# EAGLE board FPGA_S6 (EAGLE 9.6.2)
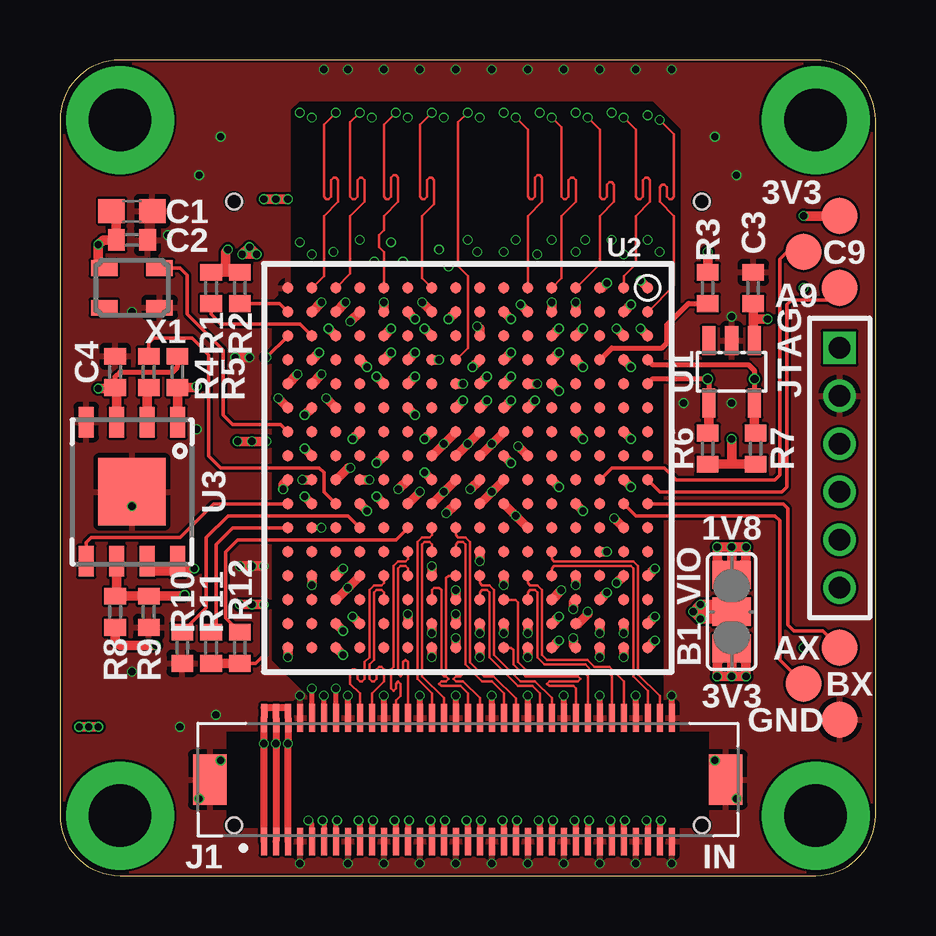
[diagram p3: board, top side]
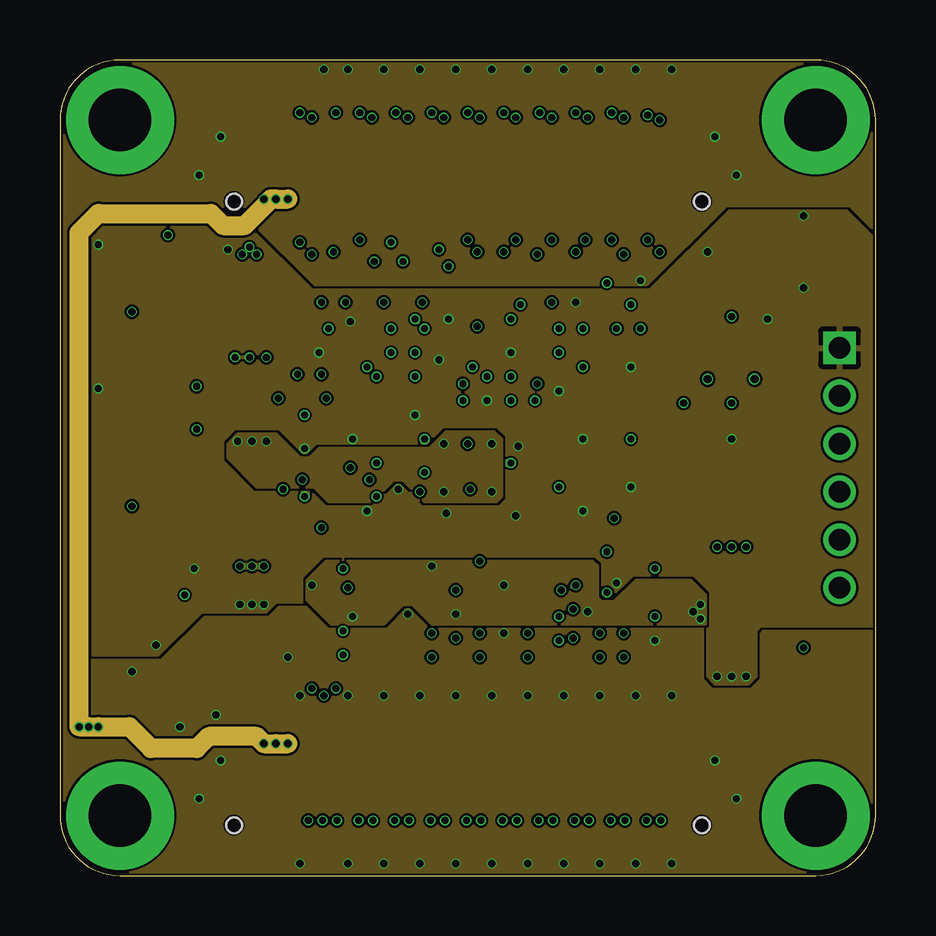
[diagram p4: board, inner layer Route2]
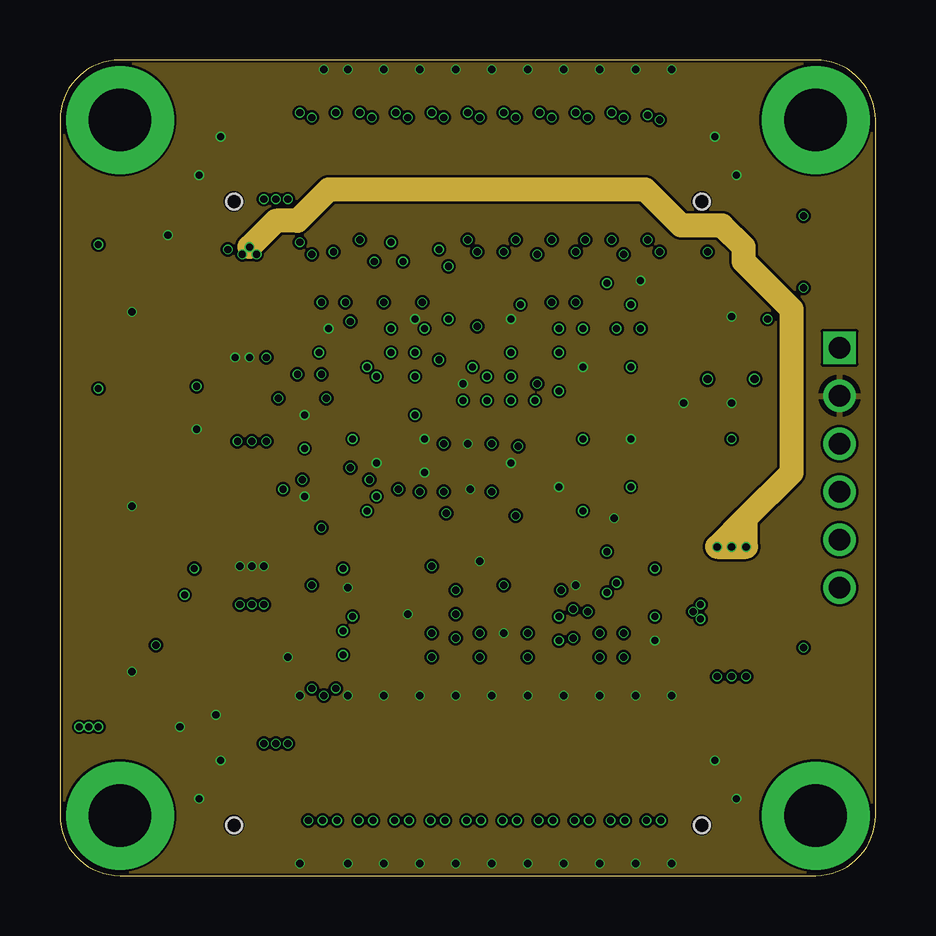
[diagram p5: board, inner layer Route3]
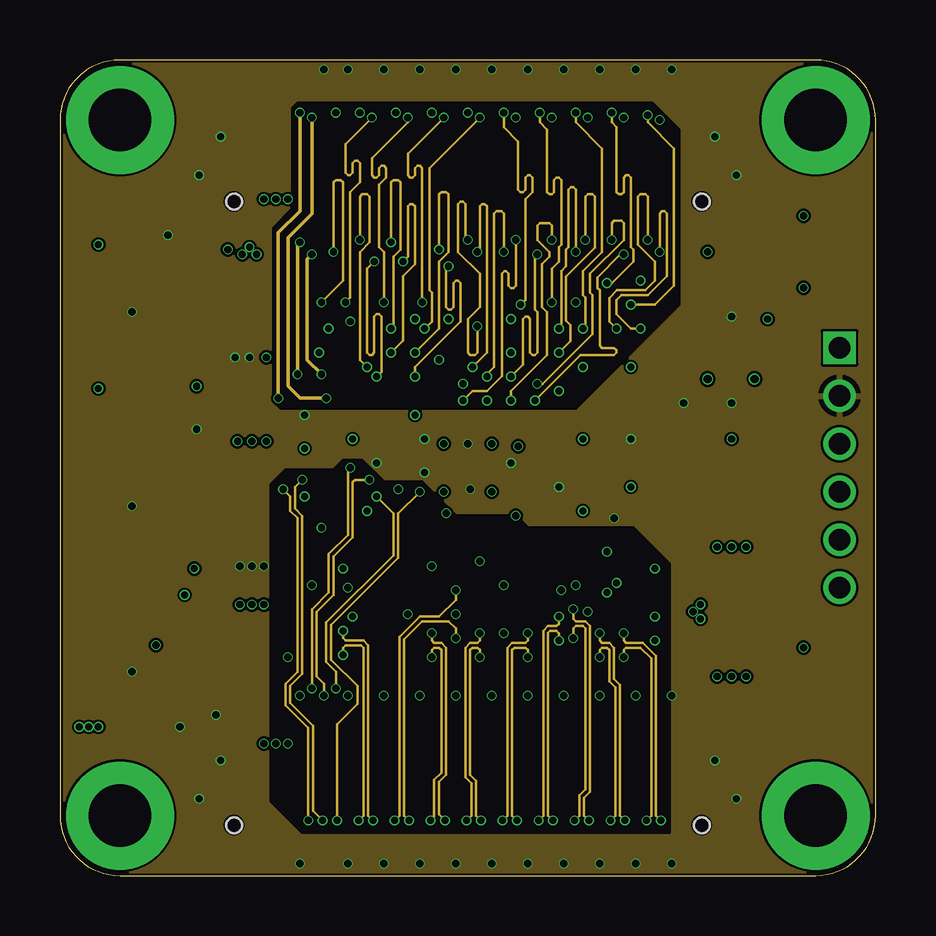
[diagram p6: board, inner layer Route14]
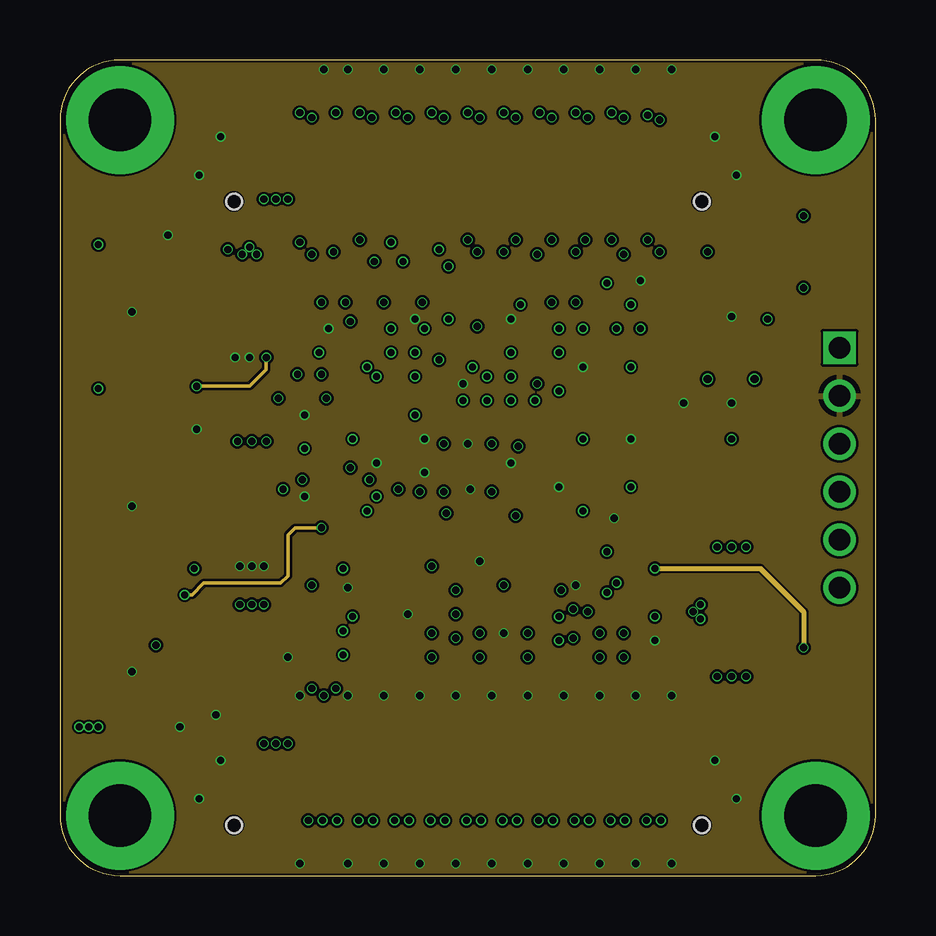
[diagram p7: board, inner layer Route15]
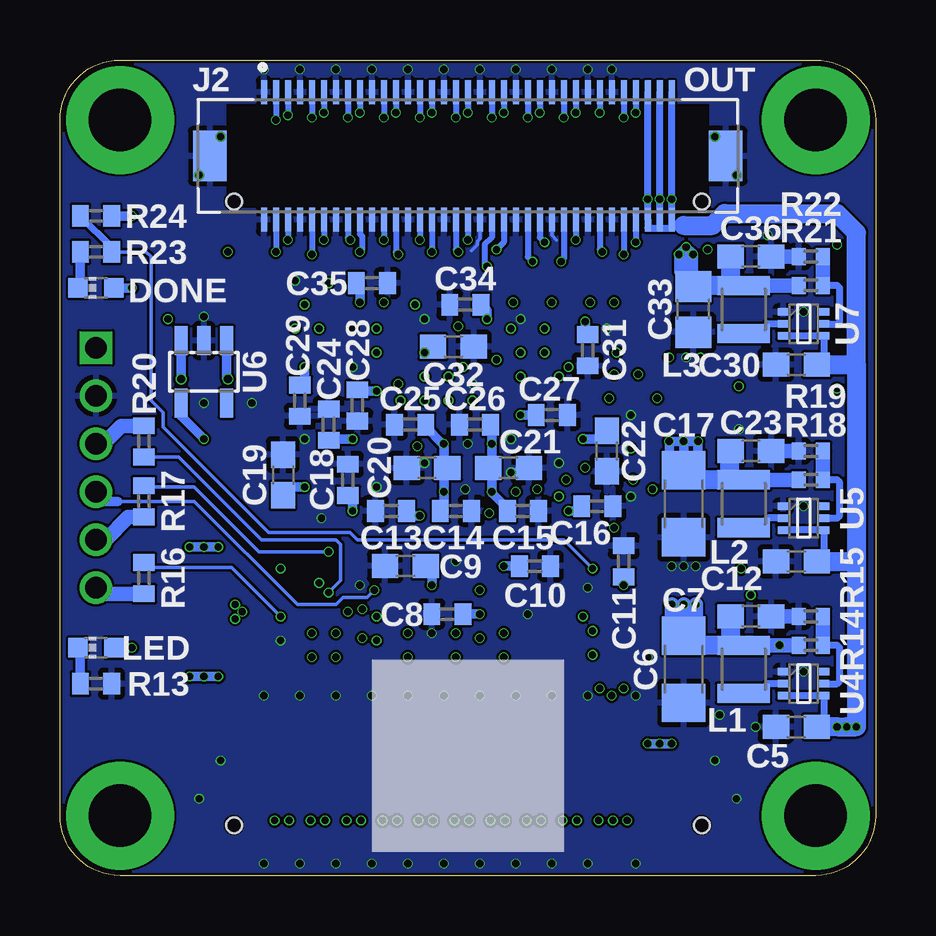
[diagram p8: board, bottom side, seen from below]

Size 34 x 34 mm. Coordinates in mm from the lower left corner, seen from the top.
Outline: 0,31.5 0,2.5 arc90 2.5,0 31.5,0 arc90 34,2.5 34,31.5 arc90 31.5,34 2.5,34 arc90 0,31.5
Copper layers (1+2*3+14*15+16): Top 0.035559375mm / dielectric 0.17018125mm / Route2 0.01778125mm / dielectric 47mil / Route3 0.0356mm / dielectric 0.2007mm / Route14 0.0356mm / dielectric 0.1499mm / Route15 0.01778125mm / dielectric 0.17018125mm / Bottom 0.035559375mm
Design rules "jlcpcb-4-layer *": minimum track width 0.08mm, minimum drill 0.2mm, track to track 0.1mm, track to pad 5mil, pad to pad 5mil, via to via 5mil, smd to smd 0mil, copper to edge 0.1mm, drill to drill 5mil, minimum pad ring 4mil, minimum via ring 0.05mm, stop-mask expansion 3mil, vias tented up to drill 100mil, thermal gap 8mil
Net classes: 0 default: width 0.14 mm, drill 0.3 mm

## Footprints (pad centres in the part's own frame; a part is rotated, then mirrored left to right if it is on the bottom)
TP15R = smd 1.5 x 1.5: TP 0,0
SJ_2 = smd 1.168 x 1.6: 1 -1.524,0; 2 0,0; 3 1.524,0
C0603 = smd 1.1 x 1: 1 -0.85,0; 2 0.85,0
C0402 = smd 0.7 x 0.9: 1 -0.65,0; 2 0.65,0
C1206 = smd 1.6 x 1.8: 1 -1.4,0; 2 1.4,0
C0805 = smd 1.3 x 1.5: 1 -0.95,0; 2 0.95,0
CHIP-LED0603 = smd 0.8 x 0.8: A 0,-0.75; C 0,0.75
DF17(2.0)-70DP-0.5V(57) = smd 0.25 x 1.15: 1 -8.5,-2.575; 2 -8.5,2.575; 3 -8,-2.575; 4 -8,2.575; 5 -7.5,-2.575; 6 -7.5,2.575; 7 -7,-2.575; 8 -7,2.575; 9 -6.5,-2.575; 10 -6.5,2.575; 11 -6,-2.575; 12 -6,2.575; 13 -5.5,-2.575; 14 -5.5,2.575; 15 -5,-2.575; 16 -5,2.575; 17 -4.5,-2.575; 18 -4.5,2.575; 19 -4,-2.575; 20 -4,2.575; 21 -3.5,-2.575; 22 -3.5,2.575; 23 -3,-2.575; 24 -3,2.575; 25 -2.5,-2.575; 26 -2.5,2.575; 27 -2,-2.575; 28 -2,2.575; 29 -1.5,-2.575; 30 -1.5,2.575; 31 -1,-2.575; 32 -1,2.575; 33 -0.5,-2.575; 34 -0.5,2.575; 35 0,-2.575; 36 0,2.575; 37 0.5,-2.575; 38 0.5,2.575; 39 1,-2.575; 40 1,2.575; 41 1.5,-2.575; 42 1.5,2.575; 43 2,-2.575; 44 2,2.575; 45 2.5,-2.575; 46 2.5,2.575; 47 3,-2.575; 48 3,2.575; 49 3.5,-2.575; 50 3.5,2.575; 51 4,-2.575; 52 4,2.575; 53 4.5,-2.575; 54 4.5,2.575; 55 5,-2.575; 56 5,2.575; 57 5.5,-2.575; 58 5.5,2.575; 59 6,-2.575; 60 6,2.575; 61 6.5,-2.575; 62 6.5,2.575; 63 7,-2.575; 64 7,2.575; 65 7.5,-2.575; 66 7.5,2.575; 67 8,-2.575; 68 8,2.575; 69 8.5,-2.575; 70 8.5,2.575 | smd 1.4 x 2.1: S1 -10.75,0; S2 10.75,0 | hole 0.65: -9.75,-1.9; 9.75,-1.9
DF17(3.0)-70DS-0.5V(57) = smd 0.25 x 1: 1 -8.5,2.65; 2 -8.5,-2.65; 3 -8,2.65; 4 -8,-2.65; 5 -7.5,2.65; 6 -7.5,-2.65; 7 -7,2.65; 8 -7,-2.65; 9 -6.5,2.65; 10 -6.5,-2.65; 11 -6,2.65; 12 -6,-2.65; 13 -5.5,2.65; 14 -5.5,-2.65; 15 -5,2.65; 16 -5,-2.65; 17 -4.5,2.65; 18 -4.5,-2.65; 19 -4,2.65; 20 -4,-2.65; 21 -3.5,2.65; 22 -3.5,-2.65; 23 -3,2.65; 24 -3,-2.65; 25 -2.5,2.65; 26 -2.5,-2.65; 27 -2,2.65; 28 -2,-2.65; 29 -1.5,2.65; 30 -1.5,-2.65; 31 -1,2.65; 32 -1,-2.65; 33 -0.5,2.65; 34 -0.5,-2.65; 35 0,2.65; 36 0,-2.65; 37 0.5,2.65; 38 0.5,-2.65; 39 1,2.65; 40 1,-2.65; 41 1.5,2.65; 42 1.5,-2.65; 43 2,2.65; 44 2,-2.65; 45 2.5,2.65; 46 2.5,-2.65; 47 3,2.65; 48 3,-2.65; 49 3.5,2.65; 50 3.5,-2.65; 51 4,2.65; 52 4,-2.65; 53 4.5,2.65; 54 4.5,-2.65; 55 5,2.65; 56 5,-2.65; 57 5.5,2.65; 58 5.5,-2.65; 59 6,2.65; 60 6,-2.65; 61 6.5,2.65; 62 6.5,-2.65; 63 7,2.65; 64 7,-2.65; 65 7.5,2.65; 66 7.5,-2.65; 67 8,2.65; 68 8,-2.65; 69 8.5,2.65; 70 8.5,-2.65 | smd 1.4 x 2.1: S1 -10.75,0; S2 10.75,0 | hole 0.65: -9.75,-1.9; 9.75,-1.9
1X06M = drill 0.914 square: 1 -5,0 | drill 0.914: 2 -3,0; 3 -1,0; 4 1,0; 5 3,0; 6 5,0
L1008 = smd 0.8 x 2.2: 1 -1,0; 2 1,0
R0402 = smd 0.7 x 0.9: 1 -0.65,0; 2 0.65,0
R0402' = smd 0.6 x 0.7: 1 -0.5,0; 2 0.5,0
SOT23-5L = smd 0.55 x 1.2: 1 -0.95,-1.3; 2 0,-1.3; 3 0.95,-1.3; 4 0.95,1.3; 5 -0.95,1.3
FT256 = smd 0.45 x 0.45: A1 -7.5,7.5; A2 -6.5,7.5; A3 -5.5,7.5; A4 -4.5,7.5; A5 -3.5,7.5; A6 -2.5,7.5; A7 -1.5,7.5; A8 -0.5,7.5; A9 0.5,7.5; A10 1.5,7.5; A11 2.5,7.5; A12 3.5,7.5; A13 4.5,7.5; A14 5.5,7.5; A15 6.5,7.5; A16 7.5,7.5; B1 -7.5,6.5; B2 -6.5,6.5; B3 -5.5,6.5; B4 -4.5,6.5; B5 -3.5,6.5; B6 -2.5,6.5; B7 -1.5,6.5; B8 -0.5,6.5; B9 0.5,6.5; B10 1.5,6.5; B11 2.5,6.5; B12 3.5,6.5; B13 4.5,6.5; B14 5.5,6.5; B15 6.5,6.5; B16 7.5,6.5; C1 -7.5,5.5; C2 -6.5,5.5; C3 -5.5,5.5; C4 -4.5,5.5; C5 -3.5,5.5; C6 -2.5,5.5; C7 -1.5,5.5; C8 -0.5,5.5; C9 0.5,5.5; C10 1.5,5.5; C11 2.5,5.5; C12 3.5,5.5; C13 4.5,5.5; C14 5.5,5.5; C15 6.5,5.5; C16 7.5,5.5; D1 -7.5,4.5; D2 -6.5,4.5; D3 -5.5,4.5; D4 -4.5,4.5; D5 -3.5,4.5; D6 -2.5,4.5; D7 -1.5,4.5; D8 -0.5,4.5; D9 0.5,4.5; D10 1.5,4.5; D11 2.5,4.5; D12 3.5,4.5; D13 4.5,4.5; D14 5.5,4.5; D15 6.5,4.5; D16 7.5,4.5; E1 -7.5,3.5; E2 -6.5,3.5; E3 -5.5,3.5; E4 -4.5,3.5; E5 -3.5,3.5; E6 -2.5,3.5; E7 -1.5,3.5; E8 -0.5,3.5; E9 0.5,3.5; E10 1.5,3.5; E11 2.5,3.5; E12 3.5,3.5; E13 4.5,3.5; E14 5.5,3.5; E15 6.5,3.5; E16 7.5,3.5; F1 -7.5,2.5; F2 -6.5,2.5; F3 -5.5,2.5; F4 -4.5,2.5; F5 -3.5,2.5; F6 -2.5,2.5; F7 -1.5,2.5; F8 -0.5,2.5; F9 0.5,2.5; F10 1.5,2.5; F11 2.5,2.5; F12 3.5,2.5; F13 4.5,2.5; F14 5.5,2.5; F15 6.5,2.5; F16 7.5,2.5; G1 -7.5,1.5; G2 -6.5,1.5; G3 -5.5,1.5; G4 -4.5,1.5; G5 -3.5,1.5; G6 -2.5,1.5; G7 -1.5,1.5; G8 -0.5,1.5; G9 0.5,1.5; G10 1.5,1.5; G11 2.5,1.5; G12 3.5,1.5; G13 4.5,1.5; G14 5.5,1.5; G15 6.5,1.5; G16 7.5,1.5; H1 -7.5,0.5; H2 -6.5,0.5; H3 -5.5,0.5; H4 -4.5,0.5; H5 -3.5,0.5; H6 -2.5,0.5; H7 -1.5,0.5; H8 -0.5,0.5; H9 0.5,0.5; H10 1.5,0.5; H11 2.5,0.5; H12 3.5,0.5; H13 4.5,0.5; H14 5.5,0.5; H15 6.5,0.5; H16 7.5,0.5; J1 -7.5,-0.5; J2 -6.5,-0.5; J3 -5.5,-0.5; J4 -4.5,-0.5; J5 -3.5,-0.5; J6 -2.5,-0.5; J7 -1.5,-0.5; J8 -0.5,-0.5; J9 0.5,-0.5; J10 1.5,-0.5; J11 2.5,-0.5; J12 3.5,-0.5; J13 4.5,-0.5; J14 5.5,-0.5; J15 6.5,-0.5; J16 7.5,-0.5; K1 -7.5,-1.5; K2 -6.5,-1.5; K3 -5.5,-1.5; K4 -4.5,-1.5; K5 -3.5,-1.5; K6 -2.5,-1.5; K7 -1.5,-1.5; K8 -0.5,-1.5; K9 0.5,-1.5; K10 1.5,-1.5; K11 2.5,-1.5; K12 3.5,-1.5; K13 4.5,-1.5; K14 5.5,-1.5; K15 6.5,-1.5; K16 7.5,-1.5; L1 -7.5,-2.5; L2 -6.5,-2.5; L3 -5.5,-2.5; L4 -4.5,-2.5; L5 -3.5,-2.5; L6 -2.5,-2.5; L7 -1.5,-2.5; L8 -0.5,-2.5; L9 0.5,-2.5; L10 1.5,-2.5; L11 2.5,-2.5; L12 3.5,-2.5; L13 4.5,-2.5; L14 5.5,-2.5; L15 6.5,-2.5; L16 7.5,-2.5; M1 -7.5,-3.5; M2 -6.5,-3.5; M3 -5.5,-3.5; M4 -4.5,-3.5; M5 -3.5,-3.5; M6 -2.5,-3.5; M7 -1.5,-3.5; M8 -0.5,-3.5; M9 0.5,-3.5; M10 1.5,-3.5; M11 2.5,-3.5; M12 3.5,-3.5; M13 4.5,-3.5; M14 5.5,-3.5; M15 6.5,-3.5; M16 7.5,-3.5; N1 -7.5,-4.5; N2 -6.5,-4.5; N3 -5.5,-4.5; N4 -4.5,-4.5; N5 -3.5,-4.5; N6 -2.5,-4.5; N7 -1.5,-4.5; N8 -0.5,-4.5; N9 0.5,-4.5; N10 1.5,-4.5; N11 2.5,-4.5; N12 3.5,-4.5; N13 4.5,-4.5; N14 5.5,-4.5; N15 6.5,-4.5; N16 7.5,-4.5; P1 -7.5,-5.5; P2 -6.5,-5.5; P3 -5.5,-5.5; P4 -4.5,-5.5; P5 -3.5,-5.5; P6 -2.5,-5.5; P7 -1.5,-5.5; P8 -0.5,-5.5; P9 0.5,-5.5; P10 1.5,-5.5; P11 2.5,-5.5; P12 3.5,-5.5; P13 4.5,-5.5; P14 5.5,-5.5; P15 6.5,-5.5; P16 7.5,-5.5; R1 -7.5,-6.5; R2 -6.5,-6.5; R3 -5.5,-6.5; R4 -4.5,-6.5; R5 -3.5,-6.5; R6 -2.5,-6.5; R7 -1.5,-6.5; R8 -0.5,-6.5; R9 0.5,-6.5; R10 1.5,-6.5; R11 2.5,-6.5; R12 3.5,-6.5; R13 4.5,-6.5; R14 5.5,-6.5; R15 6.5,-6.5; R16 7.5,-6.5; T1 -7.5,-7.5; T2 -6.5,-7.5; T3 -5.5,-7.5; T4 -4.5,-7.5; T5 -3.5,-7.5; T6 -2.5,-7.5; T7 -1.5,-7.5; T8 -0.5,-7.5; T9 0.5,-7.5; T10 1.5,-7.5; T11 2.5,-7.5; T12 3.5,-7.5; T13 4.5,-7.5; T14 5.5,-7.5; T15 6.5,-7.5; T16 7.5,-7.5
MT25QL128ABA1EW7-0SIT = smd 1.27 x 0.635: 1 -2.9,1.905; 2 -2.9,0.635; 3 -2.9,-0.635; 4 -2.9,-1.905; 5 2.9,-1.905; 6 2.9,-0.635; 7 2.9,0.635; 8 2.9,1.905 | smd 2.8 x 2.8: EP 0,0
SOTFL50P160X60-6N = smd 0.475 x 0.3: 1 -0.838,0.5; 2 -0.838,0; 3 -0.838,-0.5; 4 0.838,-0.5; 5 0.838,0; 6 0.838,0.5
ASE = smd 1.1 x 0.65: 1 -1.15,-0.825; 2 1.15,-0.825; 3 1.15,0.825; 4 -1.15,0.825

## Placement (x,y rotation side)
$$GND1  TPTP15R  [TP15R]  32.5,27.5 0 top
A9  TPTP15R  [TP15R]  32.5,24.5 0 top
AX  TPTP15R  [TP15R]  32.5,9.5 0 top
B1  [SJ_2]  28,11 90 top
BX  TPTP15R  [TP15R]  31,8 0 top
C1  4u7  [C0603]  3,27.7 180 top
C2  100n  [C0402]  3,26.5 0 top
C3  100n  [C0402]  28.9,24.5 90 top
C4  100n  [C0402]  2.3,21 270 top
C5  4u7  [C0603]  3.3,6.2 180 bottom
C6  100u  [C1206]  8,8.6 270 bottom
C7  22u  [C0603]  5.2,10.8 0 bottom
C8  470n  [C0402]  17.85,10.9 0 bottom
C9  4u7  [C0603]  19.6,12.9 0 bottom
C10  470n  [C0402]  14.2,12.9 180 bottom
C11  470n  [C0402]  10.5,13.1 270 bottom
C12  4u7  [C0603]  3.3,13.1 180 bottom
C13  470n  [C0402]  20.2,15.2 0 bottom
C14  47n  [C0402]  17.5,15.2 180 bottom
C15  470n  [C0402]  14.7,15.2 180 bottom
C16  470n  [C0402]  11.6,15.4 180 bottom
C17  100u  [C1206]  8,15.5 270 bottom
C18  470n  [C0402]  22,16.5 270 bottom
C19  4u7  [C0603]  24.7,16.7 270 bottom
C20  4u7  [C0603]  18.7,17 0 bottom
C21  4u7  [C0603]  15.3,17 180 bottom
C22  4u7  [C0603]  11.2,17.7 90 bottom
C23  22u  [C0603]  5.2,17.7 0 bottom
C24  470n  [C0402]  22.8,18.8 270 bottom
C25  470n  [C0402]  19.4,18.8 0 bottom
C26  47n  [C0402]  16.7,18.8 0 bottom
C27  470n  [C0402]  13.5,19.2 180 bottom
C28  470n  [C0402]  21.6,19.6 90 bottom
C29  470n  [C0402]  24,19.8 90 bottom
C30  4u7  [C0603]  3.3,21.3 180 bottom
C31  470n  [C0402]  12,21.9 90 bottom
C32  4u7  [C0603]  17.6,22.05 180 bottom
C33  47u  [C0805]  7.6,23.6 90 bottom
C34  470n  [C0402]  17.1,23.8 0 bottom
C35  470n  [C0402]  21,24.7 180 bottom
C36  22u  [C0603]  5.2,25.8 0 bottom
CC9  TPTP15R  [TP15R]  31,26 0 top
DONE  RED  [CHIP-LED0603]  32.5,24.5 90 bottom
GND  TPTP15R  [TP15R]  32.5,6.5 0 top
J1  DF17(2.0)-70DP-0.5V(57)  [DF17(2.0)-70DP-0.5V(57)]  17,4 0 top
J2  DF17(3.0)-70DS-0.5V(57)  [DF17(3.0)-70DS-0.5V(57)]  17,30 0 bottom
JTAG  [1X06M]  32.5,17 270 top
L1  1u  [L1008]  5.5,8.6 270 bottom
L2  1u  [L1008]  5.5,15.5 270 bottom
L3  1u  [L1008]  5.5,23.6 270 bottom
LED  RED  [CHIP-LED0603]  32.5,9.5 90 bottom
R1  4k7  [R0402]  6.3,24.5 90 top
R2  4k7  [R0402]  7.5,24.5 270 top
R3  1k  [R0402]  27,24.5 270 top
R4  100R  [R0402]  3.7,21 90 top
R5  2k4  [R0402]  4.9,21 90 top
R6  4k7  [R0402]  27,17.8 90 top
R7  4k7  [R0402]  29,17.8 90 top
R8  100R  [R0402]  2.3,11 90 top
R9  100R  [R0402]  3.7,11 270 top
R10  1k  [R0402]  5.1,9.5 270 top
R11  1k  [R0402]  6.3,9.5 90 top
R12  1k  [R0402]  7.5,9.5 90 top
R13  1k  [R0402]  32.5,8 180 bottom
R14  453k  [R0402']  2.7,9.6 0 bottom
R15  100k  [R0402']  2.7,10.8 0 bottom
R16  100R  [R0402]  30.5,12.4 90 bottom
R17  100R  [R0402]  30.5,15.6 90 bottom
R18  100k  [R0402']  2.7,16.5 0 bottom
R19  100k  [R0402']  2.7,17.7 0 bottom
R20  100R  [R0402]  30.5,18.1 270 bottom
R21  200k  [R0402']  2.7,24.6 0 bottom
R22  100k  [R0402']  2.7,25.8 0 bottom
R23  1k  [R0402]  32.5,26 180 bottom
R24  1k  [R0402]  32.5,27.5 0 bottom
U1  MCP9802A0T  [SOT23-5L]  28,21 180 top
U2  XC6SLX16-2FTG256I  [FT256]  17,17 270 top
U3  MT25QL128ABA1EW7-0SIT  [MT25QL128ABA1EW7-0SIT]  3,16 270 top
U4  TPS62A01ADRL  [SOTFL50P160X60-6N]  3,8 0 bottom
U5  TPS62A01ADRL  [SOTFL50P160X60-6N]  3,14.9 0 bottom
U6  24C00OT  [SOT23-5L]  28,21 180 bottom
U7  TPS62A01ADRL  [SOTFL50P160X60-6N]  3,23 0 bottom
X1  50MHz  [ASE]  3,24.5 0 top

## Tracks (layer width: path | path; a pad name or v marks a point on that pad's centre or on a via)
1.2V  (via drill 0.3)
  Top 0.4: U2.H10 v18,16 U2.G9 | U2.H8 v18,18 U2.G7 | U2.K8 v16,18 U2.J7 | U2.K10 v16,16 U2.J9 | v8.6,18.1 v8,18.1 v7.4,18.1
  Bottom 0.4: C17.1 v8,18.1 | C14.2 18,15.35 v18,16 18,16.85 C20.2 18,17.15 v18,18 18.05,18 18.75,18.7 C25.2 | C15.2 15.35,15.3 16,15.95 v16,16 16,16.85 C21.2 16,17.15 v16,18 16,18.75 C26.2 | C17.1 7.4,17.5 v7.4,18.1 v8,18.1 | C17.1 8.6,17.5 v8.6,18.1 v8,18.1
  Bottom 0.6: R18.1 L2.1 6,16.5 6.1,16.6 | C23.1 6.1,17.65
  Bottom 0.8: 6.1,17.65 6.1,16.6 | L2.1 7.6,16.5 C17.1
  pour Route2 (rank 2): 7,18 7.4,18.4 9,18.4 10,17.4 10.4,17.4 10.8,17.8 15.4,17.8 16.1,18.5 18.1,18.5 18.4,18.2 18.4,15.8 18.2,15.6 15.2,15.6 14.3,16.5 13.9,16.5 13,15.6 11.2,15.6 10.6,16.2 8.2,16.2 7,17.4
1.8V  (via drill 0.3)
  Top 0.4: B1.3 v28,13.7 | B1.3 27.4,13.12 v27.4,13.7 v28,13.7 | B1.3 28.6,13.12 v28.6,13.7 v28,13.7 | v7.6,25.9 v7.9,26.2 v8.2,25.9 v7.6,25.9
  Route3 0.4: v7.6,25.9 v7.9,26.2 v8.2,25.9
  Route3 1: 28.6,14.9 v28.6,13.7 v28,13.7 v27.4,13.7 28.6,14.9 | v7.9,26.2 9,27.3 9.9,27.3 11.2,28.6 24.4,28.6 25.9,27.1 27.6,27.1 28.5,26.2 28.5,25.6 30.5,23.6 30.5,16.8 28.6,14.9
  Bottom 0.4: C33.2 v7.6,25.9 v7.9,26.2 | C33.2 7.9,24.85 v7.9,26.2 | C33.2 8.2,25.15 v8.2,25.9 v7.9,26.2 | v27.4,13.7 v28,13.7 v28.6,13.7
  Bottom 0.6: R21.1 L3.1 6.2,24.6 6.05,24.75 | 7.45,24.6 C33.2
  Bottom 0.8: C36.1 6.05,24.75 | L3.1 7.45,24.6
3.3V  (via drill 0.3)
  Top 0.15: R12.1 8.15,8.85 8.5,9.2 v8.5,11.3
  Top 0.2: C4.2 2.3,20.8 2.5,21 4.7,21 4.9,21.2 R5.2
  Top 0.4: B1.1 v28,8.3 | B1.1 28.6,8.88 v28.6,8.3 v28,8.3 | B1.1 27.4,8.88 v27.4,8.3 v28,8.3 | U3.3 2.37,20.29 C4.2 2.25,20.3 v1.6,20.3 | R8.1 2.3,9.8 2.5,9.6 v4,9.6 | U3.8 4.9,12.8 | 4.9,12.8 4.9,12.7 3.63,12.7 U3.7 | v5.6,12.8 4.9,12.8 | R5.2 4.9,21.7 | R3.1 v27,26 | C1.2 2.35,27.5 C2.1 1.8,26.5 v1.6,26.3 1.6,25.57 X1.4 | R2.1 6.9,25.15 | 6.9,25.15 R1.2 | U2.B13 v23.2,12.2 | U2.R4 v10.8,21.8 | v12.1,23.1 U2.N2 | v15.8,21.5 U2.K4 | v16.2,23.2 U2.J2 | U2.L6 v14.8,19.2 | v12.2,18.2 U2.N7 | v10.2,17.8 U2.R8 | U2.H6 v17.8,19.8 | v18.8,21.8 U2.G4 | v20.8,20.2 U2.E5 | U2.D7 v21.8,18.2 | U2.G10 v19,15 U2.F11 | v21.8,15.2 U2.D10 | U2.B9 v23.8,16.2 | v23.8,21.2 U2.B4 | v21.5,23.9 U2.D2 | v12.8,15.2 U2.N10 | U2.L9 v14.1,16.1 | U2.J10 v16.1,15.1 | v19.1,17.9 U2.F8 | R11.1 R12.1 | v7,26.1 6.9,26 6.9,25.15 | v7.5,11.3 v8,11.3 v8.5,11.3 | R6.1 28,17.15 | 28,17.15 R7.1 | U1.1 28.9,22.35 28.9,23.2 | 28.9,23.2 C3.1 | 28.9,23.2 v29.5,23.2 | 28,17.15 v28,18.2 | $$GND1.TP v31,27.5
  Bottom 0.4: R24.2 v31,27.5 | DONE.A v31,24.5 | v21.8,18.2 22.75,18.2 C24.2 | v20.8,20.2 21.55,20.2 C28.2 | v23.8,21.2 23.8,20.65 C29.2 | v23.8,16.2 24.35,16.2 C19.2 | v21.8,15.2 21.8,15.65 C18.2 | v19,15 19.35,15 C13.2 | C27.2 v14.8,19.2 | C22.2 11.55,18.2 v12.2,18.2 | v12.8,15.2 12.45,15.2 C16.2 | C31.2 12.1,22.65 v12.1,23.1 | C32.2 18.55,22.05 v18.8,21.8 | C34.2 16.2,23.55 v16.2,23.2 | v21.5,23.9 21.5,24.55 C35.2 | v27.4,8.3 v28,8.3 v28.6,8.3 | U6.4 28.95,19.15 v28,18.2
  Bottom 0.6: R14.1 L1.1 6,9.6 6.05,9.65 | 7.6,9.6 C6.1 | C6.1 7.5,10.5 v7.5,11.3 | C6.1 v8,11.3 | C6.1 8.5,10.5 v8.5,11.3
  Bottom 0.8: C7.1 6.05,9.65 | L1.1 7.6,9.6
  pour Route2 (rank 4): 1.3,27.1 7.8,27.1 10.5,24.4 24.6,24.4 27.9,27.7 32.8,27.7 34,26.5 34,10.4 29.2,10.4 29,10.2 29,8.3 28.7,8 27.3,8 27,8.3 27,11.4 9,11.4 8.6,11 5.9,11 4.1,9.2 1.3,9.2
50MHZ
  Top 0.15: U2.T7 9.2,18.8 7.2,18.8
  Top 0.152: 7.2,18.8 6.8,19.2 6.8,21.9 5.3,23.4 5.3,25.02 5,25.32 X1.3
+5V  (via drill 0.3)
  Top 0.3: J1.3 J1.4 9,7 | J1.1 J1.2 8.5,7 9,7 | 9,7 9.5,7 J1.6 v9.5,5.5 J1.5
  Top 0.4: v8.5,28.2 v9,28.2 v9.5,28.2 | v0.8,6.2 v1.2,6.2 v1.6,6.2
  Route2 0.4: v9,28.2 v8.5,28.2
  Route2 0.8: v9.5,5.5 v9,5.5 v8.5,5.5 8.2,5.8 6.2,5.8 5.7,5.3 3.8,5.3 2.9,6.2 v1.6,6.2 v1.2,6.2 v0.8,6.2 0.8,26.8 1.6,27.6 6.3,27.6 6.8,27.1 7.7,27.1 8.8,28.2 v9,28.2 v9.5,28.2
  Bottom 0.3: U4.3 U4.4 2.16,6.26 2.1,6.2 | U5.3 U5.4 2.16,13.16 2.1,13.1 | U7.3 U7.4 2.16,21.36 2.1,21.3 | 8.5,27.1 8,27.1 | J2.69 v8.5,28.2 J2.70 8.5,27.1 | J2.67 v9,28.2 J2.68 9,27 | J2.65 v9.5,28.2 J2.66 9.5,27 9,27 | 9,27 8.5,27 8.5,27.1
  Bottom 0.4: v9.5,5.5 v9,5.5 v8.5,5.5
  Bottom 0.6: C30.1 2.1,21.3 | C12.1 2.1,13.1 | 2.1,6.2 C5.1
  Bottom 0.8: 2.1,21.3 0.8,21.3 | 2.1,13.1 0.8,13.1 | 0.8,21.3 0.8,13.1 | 0.8,13.1 v0.8,6.2 v1.2,6.2 v1.6,6.2 2.1,6.2 | 0.8,21.3 0.8,26.8 1.6,27.6 6.3,27.6 6.8,27.1 8,27.1
CMPCS
  Top 0.15: R12.2 6.9,10.75 6.9,13.5 7.4,14 14,14 U2.L11
FLASH_!CS  (via drill 0.3)
  Top 0.15: U2.T3 v8.6,21.6
  Top 0.4: U3.1 R5.1 5.65,20.35 v5.7,20.4
  Route15 0.15: v5.7,20.4 7.9,20.4 8.6,21.1 v8.6,21.6
FLASH_MISO
  Top 0.15: U2.P10 11,16 11,16.8 10.8,17 6.7,17 6.2,17.5 6.2,21.7 5.5,22.4 3.9,22.4 3.7,22.2 R4.2
FLASH_MOSI
  Top 0.15: U3.5 1.1,13.89 1.3,14.1 5,14.1 6.4,15.5 U2.T10
FLASH_SCK  (via drill 0.3)
  Top 0.15: U2.R11 v10.9,14.5
  Top 0.4: U3.6 2.37,11.71 R8.2 R9.1 5.15,11.65 v5.2,11.7
  Route15 0.15: v5.2,11.7 5.5,11.7 6,12.2 9.2,12.2 9.5,12.5 9.5,14.2 9.8,14.5 v10.9,14.5
FPGA_B15  (via drill 0.3)
  Top 0.25: v25.05,2.3 25,2.25 J1.67
  Top 0.4: v23.5,10.1 U2.B15
  Route14 0.1: v25.05,2.3 24.85,2.5 24.85,9.15 24.3,9.7 23.6,9.7 23.5,9.8 v23.5,10.1
FPGA_B16  (via drill 0.3)
  Top 0.25: v24.45,2.3 24.5,2.25 J1.65
  Top 0.4: v23.5,9.1 U2.B16
  Route14 0.1: v24.45,2.3 24.65,2.5 24.65,9.05 24.2,9.5 23.6,9.5 23.5,9.4 v23.5,9.1
FPGA_C15  (via drill 0.3)
  Top 0.25: J1.61 23.5,2.22 23.55,2.28 v23.55,2.3
  Top 0.4: U2.C15 v22.5,10.1
  Route14 0.1: v23.55,2.3 23.35,2.5 23.35,7.95 23.1,8.2 23.1,9.5 22.9,9.7 22.6,9.7 22.5,9.8 v22.5,10.1
FPGA_C16  (via drill 0.3)
  Top 0.25: J1.59 23,2.25 v22.95,2.3
  Top 0.4: U2.C16 v22.5,9.1
  Route14 0.1: v22.95,2.3 23.15,2.5 23.15,7.85 22.9,8.1 22.9,9.4 22.8,9.5 22.6,9.5 22.5,9.4 v22.5,9.1
FPGA_D14  (via drill 0.3)
  Top 0.25: v22.05,2.3 22,2.25 J1.55
  Top 0.4: U2.D14 21.4,11.4 v21.4,11.1
  Route14 0.1: v22.05,2.3 21.85,2.5 21.85,3.25 22.1,3.5 22.1,10.4 21.9,10.6 21.5,10.6 21.4,10.7 v21.4,11.1
FPGA_D16  (via drill 0.3)
  Top 0.25: J1.53 21.5,2.25 v21.45,2.3
  Top 0.4: v21.4,9.9 21.4,9.6 U2.D16
  Route14 0.1: v21.45,2.3 21.65,2.5 21.65,3.35 21.9,3.6 21.9,10.3 21.8,10.4 21.5,10.4 21.4,10.3 v21.4,9.9
FPGA_E12
  Top 0.1: J1.68 25,7.48 24.1,8.38 24.1,12.9 23.9,13.1 20.6,13.1 20.5,13.2 U2.E12
FPGA_E13
  Top 0.1: J1.66 24.5,7.7 23.9,8.3 23.9,12.8 23.8,12.9 20.6,12.9 20.5,12.8 U2.E13
FPGA_E15  (via drill 0.3)
  Top 0.25: J1.47 20,2.25 v19.95,2.3
  Top 0.4: U2.E15 v20.8,10.8
  Route14 0.1: v19.95,2.3 20.15,2.5 20.15,10.2 20.35,10.4 20.7,10.4 20.8,10.5 v20.8,10.8
FPGA_E16  (via drill 0.3)
  Top 0.25: v20.55,2.3 20.5,2.25 J1.49
  Top 0.4: U2.E16 v20.8,9.8
  Route14 0.1: v20.55,2.3 20.35,2.5 20.35,10.12 20.43,10.2 20.7,10.2 20.8,10.1 v20.8,9.8
FPGA_F13
  Top 0.1: J1.62 23.5,8.1 22.9,8.7 22.28,8.7 21.98,9 20.3,9 20.1,9.2 20.1,11.9 19.9,12.1 19.6,12.1 19.5,12.2 U2.F13
FPGA_F14
  Top 0.1: J1.60 23,8.3 22.8,8.5 22.2,8.5 21.9,8.8 20.2,8.8 19.9,9.1 19.9,11.8 19.8,11.9 19.6,11.9 19.5,11.8 U2.F14
FPGA_F15  (via drill 0.3)
  Top 0.25: J1.41 18.5,2.25 v18.45,2.3
  Top 0.4: U2.F15 v19.5,10.1
  Route14 0.1: v18.45,2.3 18.65,2.5 18.65,9.5 18.85,9.7 19.4,9.7 19.5,9.8 v19.5,10.1
FPGA_F16  (via drill 0.3)
  Top 0.25: v19.05,2.3 19,2.25 J1.43
  Top 0.4: v19.5,9.1 U2.F16
  Route14 0.1: v19.05,2.3 18.85,2.5 18.85,9.4 18.95,9.5 19.4,9.5 19.5,9.4 v19.5,9.1
FPGA_G12
  Top 0.1: J1.56 22,8.3 21.8,8.5 19.5,8.5 19.1,8.9 19.1,11.38 18.98,11.5 U2.G14
FPGA_H11
  Top 0.1: J1.54 21.5,7.8 21.4,7.9 20.4,7.9 20.3,8 20.4,8.1 21.6,8.1 21.7,8.2 21.6,8.3 19.4,8.3 18.9,8.8 18.9,9.4 18.8,9.5 U2.G16
FPGA_H13
  Top 0.1: J1.50 20.5,7.4 19.8,8.1 19.2,8.1 18.1,9.2 18.1,11.9 17.9,12.1 17.6,12.1 17.5,12.2 U2.H13
FPGA_H14
  Top 0.1: J1.48 20,7.6 19.7,7.9 19.1,7.9 17.9,9.1 17.9,11.8 17.8,11.9 17.6,11.9 17.5,11.8 U2.H14
FPGA_H15  (via drill 0.3)
  Top 0.25: J1.35 17,2.25 v16.95,2.3
  Top 0.4: v17.5,10.1 U2.H15
  Route14 0.1: v16.95,2.3 17.15,2.5 17.15,3.85 16.9,4.1 16.9,9.5 17.1,9.7 17.4,9.7 17.5,9.8 v17.5,10.1
FPGA_H16  (via drill 0.3)
  Top 0.25: v17.55,2.3 17.5,2.25 J1.37
  Top 0.4: v17.5,9.1 U2.H16
  Route14 0.1: v17.55,2.3 17.35,2.5 17.35,3.95 17.1,4.2 17.1,9.4 17.2,9.5 17.4,9.5 17.5,9.4 v17.5,9.1
FPGA_J11
  Top 0.1: J1.44 19,7.38 18.08,8.3 17.68,8.3 17.1,8.88 17.1,13.9 16.9,14.1 16.6,14.1 16.5,14.2 U2.J11
FPGA_J12
  Top 0.1: J1.42 18.5,7.6 18,8.1 17.6,8.1 16.9,8.8 16.9,13.8 16.8,13.9 16.6,13.9 16.5,13.8 U2.J12
FPGA_J13
  Top 0.1: J1.38 17.5,7.4 16.8,8.1 16.5,8.1 16.4,8.2 16.5,8.3 16.7,8.3 16.8,8.4 16.7,8.5 16.2,8.5 16.1,8.6 16.1,12.4 16.2,12.5 U2.J13
FPGA_J14  (via drill 0.3)
  Top 0.25: J1.23 14,2.25 v13.95,2.3
  Top 0.4: U2.J14 v16.5,11.9
  Route14 0.1: v13.95,2.3 14.15,2.5 14.15,9.95 15,10.8 15.8,10.8 U2.J14 v16.5,11.9
FPGA_J16  (via drill 0.3)
  Top 0.25: v14.55,2.3 14.5,2.25 J1.25
  Top 0.4: U2.J16 v16.5,9.9
  Route14 0.1: v14.55,2.3 14.35,2.5 14.35,9.85 15.1,10.6 16.2,10.6 16.5,10.3 v16.5,9.9
FPGA_K11
  Top 0.1: J1.30 15.5,7.6 14.9,8.2 14.9,13.9 15.1,14.1 15.4,14.1 15.5,14.2 U2.K11
FPGA_K12
  Top 0.1: J1.32 16,7.4 15.1,8.3 15.1,13.8 15.2,13.9 15.4,13.9 15.5,13.8 U2.K12
FPGA_K14
  Top 0.1: J1.36 17,7.6 16.7,7.9 15.9,7.9 15.8,8 15.9,8.1 16.1,8.1 16.2,8.2 16.1,8.3 16,8.3 15.9,8.4 15.9,11.9 15.8,12 15.6,12 15.5,11.9 U2.K14
FPGA_K15  (via drill 0.3)
  Top 0.25: v16.05,2.3 16,2.25 J1.31
  Top 0.4: U2.K15 v15.5,10.1
  Route14 0.1: v16.05,2.3 15.8,2.55 15.8,3.9 16.1,4.2 16.1,9.5 15.9,9.7 15.6,9.7 15.5,9.8 v15.5,10.1
FPGA_K16  (via drill 0.3)
  Top 0.25: J1.29 15.5,2.25 v15.45,2.3
  Top 0.4: U2.K16 v15.5,9.1
  Route14 0.1: v15.45,2.3 15.6,2.45 15.6,3.98 15.9,4.28 15.9,9.4 15.8,9.5 15.6,9.5 15.5,9.4 v15.5,9.1
FPGA_L10  (via drill 0.3)
  Top 0.2: J1.13 11.5,2.25 v11.55,2.3
  Top 0.4: U2.L10 v15,16
  Route14 0.1: v11.55,2.3 11.55,6.3 12.4,7.15 12.4,7.9 11.3,9 11.3,10.45 14.1,13.25 14.1,15.1 v15,16
FPGA_L12
  Top 0.1: U2.L12 14.5,13.2 14.4,13.1 14.1,13.1 13.9,12.9 13.9,8.7 13.8,8.6 13.8,7.8 13.9,7.7 14,7.8 14,8 14.1,8.1 14.2,8 14.2,7.5 14,7.3 J1.24
FPGA_L13
  Top 0.1: U2.L13 14.5,12.8 14.4,12.9 14.2,12.9 14.1,12.8 14.1,8.4 14.2,8.3 14.3,8.4 14.3,8.9 14.4,9 14.5,8.9 J1.26
FPGA_M10  (via drill 0.3)
  Top 0.2: J1.14 v11.5,7.8
  Top 0.4: U2.M10 v13.2,15.8
  Route14 0.1: v11.5,7.8 11.5,8.5 11.1,8.9 11.1,10.55 13.9,13.35 13.9,15.1 v13.2,15.8
FPGA_M13
  Top 0.1: U2.M13 13.5,12.2 13.4,12.1 13.1,12.1 12.9,11.9 12.9,9.1 12.7,8.9 12.7,8.2 12.6,8.1 12.5,8.1 12.4,8.2 12.4,8.5 12.3,8.6 12.2,8.6 12.1,8.5 12.1,8 12.5,7.6 J1.18
FPGA_M14
  Top 0.1: J1.20 13,7.6 13.5,8.1 13.5,8.6 13.4,8.7 13.3,8.7 13.2,8.6 13.2,8.2 13.1,8.1 13,8.1 12.9,8.2 12.9,8.8 13.1,9 13.1,11.8 13.2,11.9 13.4,11.9 13.5,11.8 U2.M14
FPGA_N9  (via drill 0.3)
  Top 0.2: J1.12 v11,7.5
  Top 0.4: U2.N9 v12.9,16.5
  Route14 0.1: v11,7.5 11,8 10.7,8.3 10.7,11 11.4,11.7 11.4,13.3 12.2,14.1 12.2,16.4 12.3,16.5 v12.9,16.5
FPGA_P9  (via drill 0.3)
  Top 0.2: J1.10 v10.5,7.8
  Top 0.4: U2.P9 12,17 v12.1,17
  Route14 0.1: v10.5,7.8 10.5,11.1 11.2,11.8 11.2,13.4 12,14.2 12,16.9 v12.1,17
FPGA_P15  (via drill 0.3)
  Top 0.25: v13.05,2.3 13,2.25 J1.19
  Top 0.4: U2.P15 v11.8,10.2
  Route14 0.1: v13.05,2.3 12.85,2.5 12.85,9.6 12.65,9.8 11.9,9.8 11.8,9.9 v11.8,10.2
FPGA_P16  (via drill 0.3)
  Top 0.25: J1.17 12.5,2.25 v12.45,2.3
  Top 0.4: U2.P16 v11.8,9.2
  Route14 0.1: v12.45,2.3 12.65,2.5 12.65,9.5 12.55,9.6 11.9,9.6 11.8,9.5 v11.8,9.2
FPGA_R9  (via drill 0.3)
  Top 0.2: v10.95,2.3 11,2.25 J1.11
  Top 0.4: U2.R9 v10.1,16.5
  Route14 0.1: v10.95,2.3 10.55,2.7 10.55,6.25 9.6,7.2 9.6,7.9 10.1,8.4 10.1,15 9.8,15.3 9.8,16.2 v10.1,16.5
FPGA_T9  (via drill 0.3)
  Top 0.2: J1.9 10.5,2.15 v10.35,2.3
  Top 0.4: U2.T9 9.3,16.3 v9.3,16.1
  Route14 0.1: v10.35,2.3 10.35,6.15 9.4,7.1 9.4,8 9.9,8.5 9.9,14.9 9.6,15.2 9.6,15.8 v9.3,16.1
FX3_?  (via drill 0.3)
  Top 0.1: v11.5,31.8 11,31.3 11,28.3 11.1,28.2 11.2,28.2 11.3,28.3 11.3,29 11.4,29.1 11.5,29.1 11.6,29 11.6,28.1 11,27.5 11,25 U2.R1
  Bottom 0.25: J2.57 v11.5,31.8
FX3_CTL0  (via drill 0.3)
  Top 0.4: U2.H5 v17.8,20.8
  Route14 0.1: v17.8,20.8 17.8,20.9 18.1,21.2 18.1,27.6 18.2,27.7 18.4,27.7 18.5,27.6 v18.5,26
  Bottom 0.25: J2.30 v18.5,26
FX3_CTL1  (via drill 0.3)
  Top 0.4: U2.E2 v20.5,23.9
  Route14 0.1: v20,31.8 20,31.4 20.3,31.1 20.3,28.5 20.4,28.4 20.5,28.4 20.6,28.5 20.6,29 20.7,29.1 20.8,29.1 20.9,29 20.9,26.3 20.8,26.2 20.8,25.6 20.5,25.3 v20.5,23.9
  Bottom 0.25: J2.23 v20,31.8
FX3_CTL2  (via drill 0.3)
  Top 0.4: U2.H4 v17.2,21.2
  Route14 0.1: v17.2,21.2 17.8,21.8 17.8,27.9 17.7,28 17.6,28 17.5,27.9 17.5,26.1 v17.4,26
  Bottom 0.25: J2.34 17.5,26.1 v17.4,26
FX3_CTL3  (via drill 0.3)
  Top 0.4: U2.H3 17.5,22.8 v17.4,22.9
  Route14 0.1: v17,26.5 16.9,26.6 16.9,28 16.8,28.1 16.7,28.1 16.6,28 16.6,26 17.5,25.1 17.5,23.7 17,23.2 17,21.8 17.1,21.7 17.3,21.7 17.4,21.8 v17.4,22.9
  Bottom 0.25: J2.36 v17,26.5
FX3_D0  (via drill 0.3)
  Top 0.4: U2.A3 v24.2,22.8
  Route14 0.1: v24.2,22.8 23.8,22.8 23.2,23.4 23.2,24 23.4,24.2 24.5,24.2 25.3,25 25.3,27.6 25.2,27.7 25.1,27.7 25,27.6 v25,26
  Bottom 0.25: J2.4 v25,26
FX3_D1  (via drill 0.3)
  Top 0.4: U2.B3 v23.2,22.8
  Route14 0.1: v23.2,22.8 22.9,23.1 22.9,24.08 23.22,24.4 24.4,24.4 24.8,24.8 24.8,25.6 24.1,26.3 24.1,28.3 24.2,28.4 24.4,28.4 24.5,28.3 v24.5,26.5
  Bottom 0.25: J2.6 v24.5,26.5
FX3_D2  (via drill 0.3)
  Top 0.4: U2.E3 v20.8,22.8
  Route14 0.1: v20.8,22.8 20.9,22.9 20.9,25.2 21.1,25.4 21.1,26.1 21.2,26.2 21.2,28.6 21.3,28.7 21.4,28.7 21.5,28.6 v21.5,26
  Bottom 0.25: J2.18 21.5,26.75 21.4,26.65 21.4,26.1 v21.5,26
FX3_D3  (via drill 0.3)
  Top 0.4: U2.F5 v19.9,20.5
  Route14 0.1: v19.9,20.5 20.12,20.5 22.2,22.58 22.2,24.2 22.1,24.3 22.1,25.1 23.5,26.5 23.5,27.2 23.4,27.3 23.1,27.3 23,27.2 v23,26.5
  Bottom 0.25: J2.12 v23,26.5
FX3_D4  (via drill 0.3)
  Top 0.1: v23.5,31.6 24,31.1 24,28.3 24.1,28.2 24.2,28.2 24.3,28.3 24.3,29 24.4,29.1 24.5,29.1 24.6,29 24.6,28.1 24,27.5 24,25.5 23.5,25 U2.B1
  Bottom 0.25: J2.9 v23.5,31.6
FX3_D5  (via drill 0.3)
  Top 0.4: v19.8,19.8 U2.F6
  Route14 0.1: v23.5,25.9 23.37,25.9 22.4,24.93 22.4,24.5 22.5,24.4 22.5,22.1 22.6,22 23.1,22 23.2,21.9 23.2,21.8 23.1,21.7 21.7,21.7 v19.8,19.8
  Bottom 0.25: J2.10 v23.5,25.9
FX3_D6  (via drill 0.3)
  Top 0.4: U2.B2 v23.8,23.8
  Route14 0.1: v24.5,31.7 24.5,31.4 25.6,30.3 25.6,24.6 24.8,23.8 v23.8,23.8
  Bottom 0.25: J2.5 v24.5,31.7
FX3_D7  (via drill 0.3)
  Top 0.4: U2.G6 v18.8,19.8
  Route14 0.1: v18.8,19.8 18.8,20.2 20.3,21.7 20.3,23.5 20.1,23.7 20.1,25.5 20.4,25.8 20.4,26 19.9,26.5 19.9,27.1 20,27.2 20.4,27.2 20.5,27.1 v20.5,26.5
  Bottom 0.25: J2.22 v20.5,26.5
FX3_D8  (via drill 0.3)
  Top 0.4: U2.E4 v20.8,21.8
  Route14 0.1: v20.8,21.8 21.28,22.28 21.28,22.96 21.1,23.13 21.1,24.97 22.3,26.17 22.3,28.3 22.2,28.4 22,28.4 21.9,28.3 v21.9,26.5
  Bottom 0.25: J2.16 22,26.6 v21.9,26.5
FX3_D9  (via drill 0.3)
  Top 0.1: v22,31.6 22.5,31.1 22.5,28.3 22.6,28.2 22.7,28.2 22.8,28.3 22.8,28.8 22.9,28.9 23,28.9 23.1,28.8 23.1,28.1 22.5,27.5 22.5,25.5 U2.D1
  Bottom 0.25: J2.15 v22,31.6
FX3_D10  (via drill 0.3)
  Top 0.1: U2.A2 25.6,24.6 25.6,27.5 25,28.1 25,28.7 25.1,28.8 25.2,28.8 25.3,28.7 25.3,28.3 25.4,28.2 25.5,28.2 25.6,28.3 25.6,30.9 v25,31.5
  Bottom 0.25: J2.3 v25,31.5
FX3_D11  (via drill 0.3)
  Top 0.4: U2.G5 v18.8,20.8
  Route14 0.1: v18.8,20.8 19.3,21.3 19.3,23.2 19.4,23.3 19.5,23.3 19.6,23.2 19.6,21.8 19.7,21.7 19.8,21.7 19.9,21.8 19.9,23.5 19.8,23.6 19.8,25.8 v19.9,25.9
  Bottom 0.25: J2.24 20,26 v19.9,25.9
FX3_D12  (via drill 0.3)
  Top 0.4: U2.C1 22.6,24.5 v22.8,24.7
  Route14 0.1: v23,31.8 23,31.4 23.2,31.2 23.2,28.5 23.3,28.4 23.4,28.4 23.5,28.5 23.5,29.1 23.6,29.2 23.7,29.2 23.8,29.1 23.8,26.2 23.9,26.1 23.9,25.6 23,24.7 v22.8,24.7
  Bottom 0.25: J2.11 v23,31.8
FX3_D13  (via drill 0.3)
  Top 0.4: U2.D3 v21.8,22.8
  Route14 0.1: v21.5,31.8 21.5,31.4 22.6,30.3 22.6,26 21.8,25.2 21.8,24.2 21.9,24.1 21.9,22.9 v21.8,22.8
  Bottom 0.25: J2.17 v21.5,31.8
FX3_D14  (via drill 0.3)
  Top 0.1: v20.5,31.6 20.9,31.2 20.9,28.3 21,28.2 21.1,28.2 21.2,28.3 21.2,29 21.3,29.1 21.4,29.1 21.5,29 21.5,28.1 20.9,27.5 20.9,24.9 U2.E1
  Bottom 0.25: J2.21 v20.5,31.6
FX3_D15  (via drill 0.3)
  Top 0.4: U2.J6 v16.8,19.8
  Route14 0.1: v16.8,19.8 17.2,20.2 17.8,20.2 18.42,20.82 18.42,25.1 18.52,25.2 18.6,25.2 18.7,25.1 18.7,24.6 18.8,24.5 18.9,24.5 19,24.6 v19,26.5
  Bottom 0.25: J2.28 v19,26.5
FX3_D16  (via drill 0.3)
  Top 0.1: U2.J4 17,22 17,25 16.6,25.4 16.6,31.4 v17,31.8
  Bottom 0.25: J2.35 v17,31.8
FX3_D17  (via drill 0.3)
  Top 0.4: U2.L5 v14.8,20.8
  Route14 0.1: v14.8,20.8 14.8,21.2 16.7,23.1 16.7,24.7 16.6,24.8 16.5,24.8 16.4,24.7 16.4,23.7 16.3,23.6 16.2,23.6 16.1,23.7 16.1,25.3 v16.2,25.4
  Bottom 0.25: J2.40 16,26.6 16.3,26.3 16.3,25.5 v16.2,25.4
FX3_D18  (via drill 0.3)
  Top 0.4: v12.8,21.2 U2.N4
  Route14 0.1: v12.8,21.2 U2.N4 12.5,26 12.9,26.4 12.9,28.3 12.8,28.4 12.6,28.4 12.5,28.3 v12.5,26.5
  Bottom 0.25: J2.54 v12.5,26.5
FX3_D19  (via drill 0.3)
  Top 0.1: U2.K1 15.1,24.9 15.1,27.5 15.6,28 15.6,29 15.5,29.1 15.4,29.1 15.3,29 15.3,28.3 15.2,28.2 15.1,28.2 15,28.3 15,31.3 v15.5,31.8
  Bottom 0.25: J2.41 v15.5,31.8
FX3_D20  (via drill 0.3)
  Top 0.4: U2.M3 v13.8,22.8
  Route14 0.1: v13.8,22.8 13.9,22.9 13.9,25.8 14.2,26.1 14.2,28.9 14.1,29 13.9,29 13.8,28.9 v13.8,26.4
  Bottom 0.25: J2.48 14,26.6 v13.8,26.4
FX3_D21  (via drill 0.3)
  Top 0.1: v14,31.8 13.5,31.3 13.5,28.3 13.6,28.2 13.7,28.2 13.8,28.3 13.8,29.1 13.9,29.2 14,29.2 14.1,29.1 14.1,28.1 13.5,27.5 13.5,26.9 13.3,26.7 13.3,26.2 13.5,26 U2.M1
  Bottom 0.25: J2.47 v14,31.8
FX3_D22  (via drill 0.3)
  Top 0.4: U2.M2 v13.5,23.9
  Route14 0.1: v13.5,23.9 13.5,26 13.3,26.2 13.3,28.8 13.6,29.1 13.6,29.5 13.5,29.6 13.4,29.6 13.3,29.5 13.3,29.2 13.2,29.1 13.1,29.1 13,29.2 13,29.9 14.5,31.4 v14.5,31.6
  Bottom 0.25: J2.45 v14.5,31.6
FX3_D23  (via drill 0.3)
  Top 0.4: U2.K2 v15.1,23.9
  Route14 0.1: v15.1,23.9 15.1,29.5 15,29.6 14.9,29.6 14.8,29.5 14.8,29.2 14.7,29.1 14.6,29.1 14.5,29.2 14.5,30.1 v16,31.6
  Bottom 0.25: J2.39 v16,31.6
FX3_D24  (via drill 0.3)
  Top 0.4: U2.K3 v15.2,22.8
  Route14 0.1: v17.5,31.6 15.4,29.5 15.4,24.4 15.5,24.3 15.5,23.1 v15.2,22.8
  Bottom 0.25: J2.33 v17.5,31.6
FX3_D25  (via drill 0.3)
  Top 0.4: U2.R2 v10.9,23.9
  Route14 0.1: v10.9,23.9 11.8,24.8 11.8,28.9 11.7,29 11.5,29 11.4,28.9 v11.4,26
  Bottom 0.25: J2.58 11.5,26.1 v11.4,26
FX3_D26  (via drill 0.3)
  Top 0.4: U2.M5 v13.2,20.8
  Route14 0.1: v13.2,20.8 13.4,21 13.4,23.3 13.3,23.4 13.2,23.4 13.1,23.3 13.1,21.8 13,21.7 12.9,21.7 12.8,21.8 12.8,25.3 v13.1,25.6
  Bottom 0.25: J2.52 13,25.7 v13.1,25.6
FX3_D27  (via drill 0.3)
  Top 0.4: U2.P2 v11.9,23.9
  Route14 0.1: v11.9,23.9 12.1,24.1 12.1,28.5 12.5,28.9 12.5,29.7 12.4,29.8 12.3,29.8 12.2,29.7 12.2,29.3 12.1,29.2 12,29.2 11.9,29.3 11.9,30.5 v13,31.6
  Bottom 0.25: J2.51 v13,31.6
FX3_D28  (via drill 0.3)
  Top 0.1: v12.5,31.8 12.1,31.4 12.1,28.3 12.2,28.2 12.3,28.2 12.4,28.3 12.4,29 12.5,29.1 12.6,29.1 12.7,29 12.7,28.1 12.1,27.5 12.1,25.1 U2.P1
  Bottom 0.25: J2.53 v12.5,31.8
FX3_D29  (via drill 0.3)
  Top 0.1: v19,31.6 19.5,31.1 19.5,28.3 19.6,28.2 19.7,28.2 19.8,28.3 19.8,29.1 19.9,29.2 20,29.2 20.1,29.1 20.1,28.1 19.5,27.5 U2.F1
  Bottom 0.25: J2.27 v19,31.6
FX3_D30  (via drill 0.3)
  Top 0.4: U2.L4 v14.8,21.8
  Route14 0.1: v14.8,21.8 15.8,22.8 15.8,25.6 16.2,26 16.2,28.4 16.1,28.5 15.9,28.5 15.8,28.4 v15.8,26.1
  Bottom 0.25: J2.42 15.5,26.4 v15.8,26.1
FX3_D31  (via drill 0.3)
  Top 0.4: U2.M4 v13.8,21.8
  Route14 0.1: v13.8,21.8 14.3,22.3 14.3,25 14.8,25.5 14.8,27.9 14.7,28 14.6,28 14.5,27.9 14.5,25.8 v14.3,25.6
  Bottom 0.25: J2.46 14.5,25.8 v14.3,25.6
FX3_PCLK  (via drill 0.3)
  Top 0.4: U2.F2 v19.2,23.8
  Route14 0.1: v18.5,31.8 18.5,31.2 19.1,30.6 19.1,28.6 19.2,28.5 19.3,28.5 19.4,28.6 19.4,29.1 19.5,29.2 19.6,29.2 19.7,29.1 19.7,28.5 19.4,28.2 19.4,24 v19.2,23.8
  Bottom 0.25: J2.29 v18.5,31.8
GND  (via drill 0.3)
  Top 0.25: J1.16 v12,7.5 | J1.22 v13.5,7.5 | J1.28 v15,7.5 | J1.34 v16.5,7.5 | J1.40 v18,7.5 | J1.46 v19.5,7.5 | J1.52 v21,7.5 | J1.58 v22.5,7.5 | J1.64 v24,7.5 | J1.70 v25.5,7.5
  Top 0.4: U2.G15 v18.5,10.1 | U2.A16 v24.8,9.8 | U2.D13 v21.5,12.1 | U2.H12 v17.5,13.1 | U2.L15 v14.5,10.9 | U2.P14 v12,12 U2.N13 | v9.5,9.1 U2.T16 | U2.B11 v23.1,14.9 | U2.R10 v10.2,15.8 | U2.P3 v11.2,22.8 | U2.R6 v10.2,19.2 | U2.H7 v17,18 U2.J8 | U2.K7 v15.2,18.2 | U2.M8 v13.2,17.2 | v20.8,16.2 U2.E9 | U2.B7 v23.8,18.2 | U2.H9 v17.1,16.1 | v18.8,17.2 U2.G8 | U2.K9 v15.2,16.8 | U2.D4 v21.8,21.2 | U2.J5 v16.8,20.5 | U2.L2 v14.8,23.2 | U2.G2 v18.8,23.2 | U2.A1 v24.2,24.8 | v7.3,21.6 v7.9,21.6 | v7.5,12.9 v8,12.9 v8.5,12.9
  Bottom 0.15: J2.50 13.5,26.7 13.3,26.5 | J2.38 16.5,26.55 16.6,26.45 16.6,26.3 16.85,26.05
  Bottom 0.4: C21.1 14.65,16.8 v15.2,16.8 | C20.1 19.35,17.2 v18.8,17.2
  Bottom 0.6: R22.1 C36.2 | R19.1 C23.2 | R15.1 C7.2
  other vias: 10,7.5 25.5,0.5 24,0.5 22.5,0.5 21,0.5 19.5,0.5 18,0.5 16.5,0.5 15,0.5 13.5,0.5 12,0.5 10,0.5 6.7,4.8 5.8,3.2 27.3,4.8 28.2,3.2 11,33.6 12,33.6 13.5,33.6 15,33.6 18,33.6 16.5,33.6 19.5,33.6 21,33.6 22.5,33.6 24,33.6 25.5,33.6 27.3,30.8 28.2,29.2 6.7,30.8 5.8,29.2 5,6.2 6.5,6.7 4.5,26.7 5.7,18.6 3,15.4 3,8.5 3,23.5 28,19.7 28,23.3 26,19.7
  pour Route2 (rank 6): 0,0 34,0 34,34 0,34
  pour Top: 0,0 34,0 34,34 0,34
  pour Bottom: 0,0 34,0 34,34 0,34
  pour Route15: 0,0 34,0 34,34 0,34
  cutout Top: 8.9,9 8.9,23.9 9.7,24.7 9.7,31.9 10,32.2 24.7,32.2 25.8,31.1 25.8,23.8 25.1,23.1 25.1,7 10.9,7
  pour Route3: 0,0 34,0 34,34 0,34
  pour Route14 (rank 2): 0,0 34,0 34,34 0,34
  cutout Route14: 9.7,32 9.9,32.2 24.7,32.2 25.8,31.1 25.8,23.8 21.5,19.5 9.2,19.5 8.9,19.8 8.9,27 9.7,27.8
  cutout Route14: 10.1,1.8 8.8,3.1 8.8,16.3 9.4,16.9 11.4,16.9 11.8,17.3 12.6,17.3 13.5,16.4 15.1,16.4 16.5,15 19,15 19.5,14.5 23.9,14.5 25.4,13 25.4,1.8
HSWAPEN
  Top 0.2: U2.C4 23,22 25.1,22 25.3,22.2 25.3,22.95 26.2,23.85 R3.2
INIT
  Top 0.15: U2.R3 10,23 6.7,23 6.3,23.4 R1.1
LED  (via drill 0.3)
  Top 0.4: U2.A13 v24.8,12.8
  Route15 0.2: v24.8,12.8 29.2,12.8 31,11 v31,9.5
  Bottom 0.4: LED.A v31,9.5
M0_0
  Top 0.15: R11.2 6.5,10.35 6.5,13.8 7.2,14.5 U2.T11
M1_0
  Top 0.15: R10.1 6.1,11.15 6.1,14.1 7,15 12,15 U2.N11
N$00001  (via drill 2.6 pad 4.5)
  other vias: 31.5,31.5
N$00002  (via drill 2.6 pad 4.5)
  other vias: 2.5,31.5
N$00003
  Top 0.15: BX.TP 30,9 30,14.8 29.8,15 24,15 U2.B10
N$00004
  Bottom 0.4: LED.C 33.15,9.4 R13.2
N$00005
  Bottom 0.3: U5.2 4.5,14.9 4.9,14.5 L2.2
N$00006
  Top 0.4: U3.2 3.63,20.29 R4.1
N$00007  (via drill 2.6 pad 4.5)
  other vias: 2.5,2.5
N$00008  (via drill 2.6 pad 4.5)
  other vias: 31.5,2.5
N$00009
  Top 0.15: AX.TP 31.8,10.2 30.6,10.2 30.35,10.45 30.35,15.3 30.15,15.5 U2.A10
N$00010
  Top 0.15: A9.TP 32,24 30.5,24 30.3,23.8 30.3,16.2 30.1,16 25,16 U2.A9
N$00011
  Top 0.15: CC9.TP 30.3,26 30,25.7 30,16.7 29.8,16.5 25.7,16.5 25.2,17 23,17 U2.C9
N$00019
  Bottom 0.4: R23.2 33.15,24.6 DONE.C
N$00022
  Bottom 0.6: R17.1 31.15,14.95 32.1,14 JTAG.5
N$00027
  Bottom 0.6: R20.1 31.45,18.75 32.2,18 JTAG.3
N$00031
  Bottom 0.6: R16.1 32.25,11.75 JTAG.6
N$00040
  Bottom 0.3: U5.5 1.6,14.9 1.5,15 1.5,16.4 1.6,16.5 R18.2
  Bottom 0.6: R19.2 R18.2
N$00044
  Bottom 0.3: U4.5 1.6,8 1.5,8.1 1.5,9.5 1.6,9.6 R14.2
  Bottom 0.6: R15.2 R14.2
N$00045
  Bottom 0.3: U7.2 4.5,23 4.9,22.6 L3.2
N$00049
  Bottom 0.3: U7.5 1.6,23 1.5,23.1 1.5,24.5 1.6,24.6 R21.2
  Bottom 0.6: R22.2 R21.2
N$50
  Bottom 0.3: U4.2 4.5,8 4.9,7.6 L1.2
PROG
  Top 0.15: U2.T2 9.15,23.85 R2.2
PROG_DONE  (via drill 0.3)
  Top 0.4: U2.P13 v11.8,12.8
  Bottom 0.15: R23.1 30.4,26 30.2,25.8 30.2,19.8 29.7,19.3 29.7,18.7 25.3,14.3 21.9,14.3 21.6,14 13,14 v11.8,12.8
  Bottom 0.3: R23.1 31.85,26.2 R24.1
SCL  (via drill 0.35)
  Top 0.2: U2.A5 24.7,20.7 v27,20.7 27.05,20.65 U1.4
  Top 0.4: R6.2 27.05,18.5 U1.4
  Bottom 0.4: U6.1 27.05,20.75 v27,20.7
SDA  (via drill 0.35)
  Top 0.2: U2.A4 24.7,21.3 28.7,21.3 28.95,21.05 v28.95,20.7 U1.5
  Top 0.4: R7.2 28.95,18.5 U1.5
  Bottom 0.4: U6.3 v28.95,20.7
TCK  (via drill 0.3)
  Top 0.4: U2.C14 v22.8,11.8
  Bottom 0.15: v22.8,11.8 22.3,12.3 22.3,13.8 22.5,14 25.6,14 29.05,17.45 R20.2
TDI  (via drill 0.3)
  Top 0.4: v22.8,13.5 U2.C12
  Bottom 0.15: R17.2 30.45,16.2 28.4,16.2 25.7,13.5 v22.8,13.5
TDO  (via drill 0.3)
  Top 0.4: U2.E14 v20.9,11.9
  Bottom 0.15: 31.6,15.6 28.4,15.6 24.1,11.3 22.5,11.3 22.2,11.6 21.2,11.6 v20.9,11.9
  Bottom 0.4: JTAG.4 32.1,15.6 31.6,15.6
TMS  (via drill 0.3)
  Top 0.4: v24.8,10.8 U2.A15
  Bottom 0.15: R16.2 30.3,12.85 26.85,12.85 v24.8,10.8
UART_CTS  (via drill 0.3)
  Top 0.4: U2.T6 v9.1,19.9
  Route14 0.14: v10,31.8 10,27.7 9.1,26.8
  Route14 0.15: 9.1,26.8 v9.1,19.9
  Bottom 0.25: J2.63 v10,31.8
UART_RTS  (via drill 0.3)
  Top 0.4: U2.P6 v11.1,19.9
  Route14 0.14: v10.5,31.6 10.5,27.6 9.5,26.6 9.5,20.4 10,19.9 v11.1,19.9
  Bottom 0.25: J2.61 v10.5,31.6
UART_RX  (via drill 0.3)
  Top 0.4: v10.9,20.9 U2.R5
  Route14 0.14: v10.5,25.9 10.3,25.7 10.3,21.5 v10.9,20.9
  Bottom 0.25: J2.62 v10.5,25.9
UART_TX  (via drill 0.3)
  Top 0.4: U2.T5 v9.9,20.9
  Route14 0.14: v10,26.4 9.9,26.3 v9.9,20.9
  Bottom 0.25: J2.64 v10,26.4
VIO_B1  (via drill 0.3)
  Top 0.4: v26.4,11 B1.2 | B1.2 27.7,11.3 v26.7,11.3 v26.4,11 | B1.2 27.7,10.7 v26.7,10.7 v26.4,11 | U2.D15 21.6,10.5 22,10.9 v22,11 | U2.J15 v16.5,10.9 | v18.5,12.1 U2.G13 | U2.K13 v15.5,12.9 | U2.N15 v12.2,10.8 | v10.5,12.1 U2.R13
  Bottom 0.4: C8.2 v16.5,10.9 | C10.2 v15.5,12.9 | C11.2 v10.5,12.1 | C9.2 18.5,12.65 v18.5,12.1
  pour Route2 (rank 2): 26.9,11.7 26.3,12.3 24,12.3 23.1,11.4 22.6,11.4 22.4,11.6 22.4,12.9 22.2,13.1 11.1,13.1 10.3,12.3 10.3,11.5 11.3,10.5 13.5,10.5 14.3,11.3 14.7,11.3 15.5,10.5 26.9,10.5

## Text on the board
tNames: 3V3 | C9 | 1V8 | VIO | 3V3 | IN
bNames: OUT